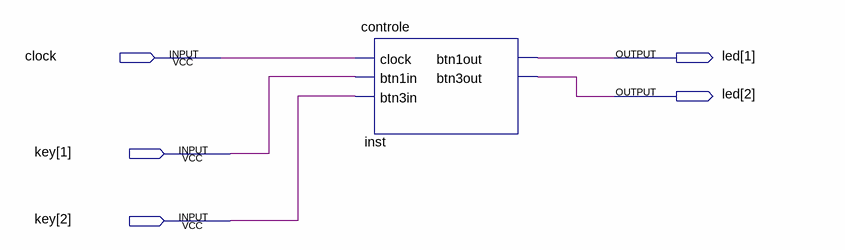
[diagram p0: schematic sheet]
// Quartus schematic teste.bdf as structural Verilog: 1 symbols, 5 pins
module teste (
  input  clock,
  input  [2:1] key,
  output [2:1] led
);

  controle inst (.clock(clock), .btn1in(key[1]), .btn3in(key[2]), .btn1out(led[1]), .btn3out(led[2]));
endmodule
